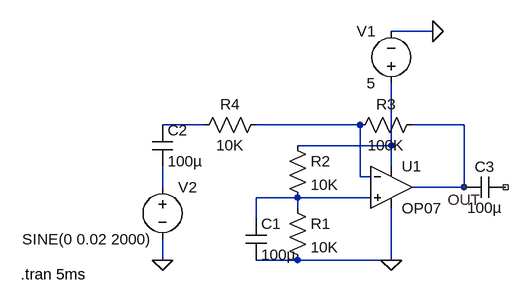
[diagram p0: schematic operational amplifier AC LTSPICE SIMULATION.asc]
operational amplifier AC LTSPICE SIMULATION.asc, the LTspice schematic file:
Version 4
SHEET 1 880 680
WIRE 288 -96 224 -96
WIRE -64 48 -128 48
WIRE 176 48 16 48
WIRE 336 48 256 48
WIRE 224 80 224 -16
WIRE 224 80 80 80
WIRE 224 112 224 80
WIRE 176 128 176 48
WIRE 192 128 176 128
WIRE -128 144 -128 112
WIRE 336 144 336 48
WIRE 336 144 256 144
WIRE 80 160 16 160
WIRE 192 160 80 160
WIRE 80 176 80 160
WIRE 16 192 16 160
WIRE -128 256 -128 224
WIRE 80 256 16 256
WIRE 224 256 224 176
WIRE 224 256 80 256
FLAG 288 -96 0
FLAG 224 256 0
FLAG 336 144 OUT
FLAG -128 256 0
SYMBOL OpAmps\\OP07 224 80 R0
SYMATTR InstName U1
SYMBOL res 64 160 R0
SYMATTR InstName R1
SYMATTR Value 10K
SYMBOL res 64 64 R0
SYMATTR InstName R2
SYMATTR Value 10K
SYMBOL cap 0 192 R0
SYMATTR InstName C1
SYMATTR Value 100µ
SYMBOL res 272 32 R90
WINDOW 0 0 56 VBottom 2
WINDOW 3 32 56 VTop 2
SYMATTR InstName R3
SYMATTR Value 100K
SYMBOL res 32 32 R90
WINDOW 0 0 56 VBottom 2
WINDOW 3 32 56 VTop 2
SYMATTR InstName R4
SYMATTR Value 10K
SYMBOL voltage 224 0 R180
WINDOW 0 24 96 Left 2
WINDOW 3 24 16 Left 2
WINDOW 123 0 0 Left 0
WINDOW 39 0 0 Left 0
SYMATTR InstName V1
SYMATTR Value 5
SYMBOL voltage -128 128 R0
WINDOW 3 -216 96 Left 2
WINDOW 123 0 0 Left 0
WINDOW 39 0 0 Left 0
SYMATTR InstName V2
SYMATTR Value SINE(0 0.02 2000)
SYMBOL cap -144 48 R0
SYMATTR InstName C2
SYMATTR Value 100µ
SYMBOL cap 400 128 R90
WINDOW 0 0 32 VBottom 2
WINDOW 3 32 32 VTop 2
SYMATTR InstName C3
SYMATTR Value 100µ
TEXT -346 278 Left 2 !.tran 5ms

The netlist it stands for:
* operational amplifier AC LTSPICE SIMULATION.asc
XU1 N005 N002 N003 0 OUT LT1001  ; OP07, pins In+ In- V+ V- OUT
R1 N005 0 10K
R2 N003 N005 10K
C1 N005 0 100µ
R3 OUT N002 100K
R4 N002 N001 10K
V1 N003 0 5
V2 N004 0 SINE(0 0.02 2000)
C2 N001 N004 100µ
C3 NC_01 OUT 100µ
.tran 5ms
.lib LTC.lib
.backanno
.end